# Altium schematic sheet MAX487.SchDoc
size 297 x 209 mm; SheetNumber: 4; SheetTotal: 12
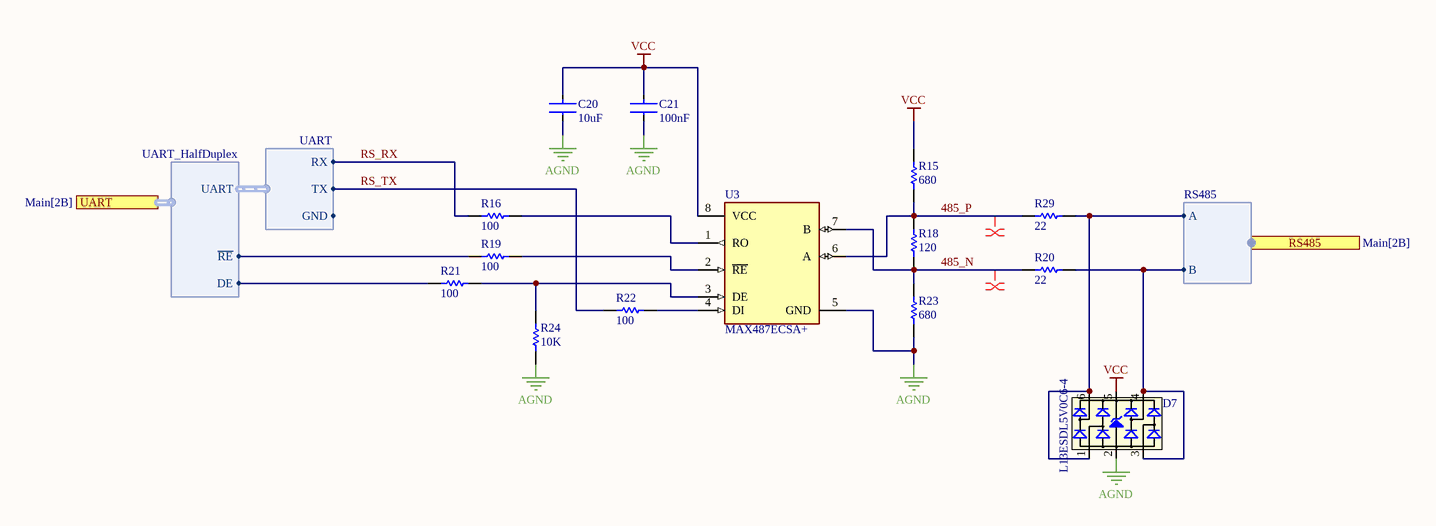
[diagram p0: MAX487.SchDoc]

## Parts
C20  10uF  [CAP-0603]
C21  100nF  [CAP-0603]
D7  L13ESDL5V0C6-4  [SOT23_6L]
R15  680  [RES-0603]
R16  100  [RES-0603]
R18  120  [RES-0603]
R19  100  [RES-0603]
R20  22  [RES-0603]
R21  100  [RES-0603]
R22  100  [RES-0603]
R23  680  [RES-0603]
R24  10K  [RES-0603]
R29  22  [RES-0603]
U3  MAX487ECSA+  [FP-S8-5-MFG]

## Ports
RS485 (harness RS485, see Main[2B]), UART (harness UART_HalfDuplex, see Main[2B])

## Harnesses
RS485: B, A
UART: TX, RX, GND
UART_HalfDuplex: ~{RE}, DE, UART

## Nets
AGND: C20.2 C21.2 D7.2(GND) R23.1 R24.1 U3.5(GND)
VCC: C20.1 C21.1 D7.5(VDD) R15.2 U3.8(VCC)
485_N: R18.1 R20.2 R23.2 U3.7(B)
485_P: R15.1 R18.2 R29.2 U3.6(A)
RS_RX: R16.1 ; harness UART.RX
RS_TX: R22.1 ; harness UART.TX
NetD7_1: D7.1(I/O1) D7.6(I/O4) R29.1 ; port RS485.A
NetD7_3: D7.3(I/O2) D7.4(I/O3) R20.1 ; port RS485.B
NetR16_2: R16.2 U3.1(RO)
NetR19_1: R19.1 ; port UART.~{RE}
NetR19_2: R19.2 U3.2(~{RE})
NetR21_1: R21.1 ; port UART.DE
NetR21_2: R21.2 R24.2 U3.3(DE)
NetR22_2: R22.2 U3.4(DI)

## Layout directives
differential pair: 485_N, 485_P

## Notes on the sheet
- Title
- Size:
- Date:
- A4
- Variant :
- Time:
- Sheet
- Revision:
- of
- Company Link :
- Designer:
- Designer Link:
- www.fatehscan.com
- File:

## Library data of the parts
C20 C21 = CAP-Ceramic: Chip Multilayer Ceramic Capacitors for General Purpose, 0603; Voltage Rating (DC): 6.3V; Dielectric: X5R; Tolerance: 20%; Packaging: Tape and Reel; Width: 0.031inch; Termination: SMD/SMT; Package Quantity: 4000; Voltage Rating: 6.3V; Case/Package: 0603; Min Operating Temperature: -55°C; Voltage: 6.3V; Length: 1.6mm; Thickness: 0.035inch; Lead Free: Lead Free; Depth: 0.8mm; Case Code (Imperial): 0603; Max Operating Temperature: 85°C; Material: Ceramic; Height: 0.8mm; Mount: Surface Mount; REACH SVHC: No SVHC; Radiation Hardening: No; Case Code (Metric): 1608
  C20: Capacitance: 10uF
  C21: Capacitance: 100nF
D7 = CMP-1486-00004-1: TVS Diode WE-TVS-HS, VRWM=5V; Reverse Stand Off Voltage: 5V; Number of Channels: 4 Channel; ComponentLink2Description: Datasheet; ComponentLink2URL: https://www.javanelec.com/CustomAjax/GetAppDocument/f6ec3046-032c-4095-b63d-5dd0486e1189?type=1&inlineName=True; PartNumber: L13ESDL5V0C6-4; PackageReference: SOT23_6L
R15 R23 = RES_SMD: Chip Resistor; Manufacturer: Vishay Semiconductor; Voltage Rating: 75 V; value: 390; Min Operating Temperature: -55 degC; ComponentLink1URL: http://www.vishay.com/; ComponentLink1Description: Manufacturer URL; PackageReference: =Footprints; Packaging: Tape and Reel; Max Operating Temperature: 155 degC; Mount: Surface Mount; ComponentLink2Description: Datasheet; PackageDescription: 2-Pin Surface Mount Device, Body 1.575 x 0.85 mm; Length: 1.55 mm; ComponentLink2URL: http://www.vishay.com/docs/20035/dcrcwe3.pdf; Pins: 2; RoHSCompliant: true
R16 R19-R22 R24 R29 = RES_SMD: Chip Resistor; Manufacturer: Vishay Semiconductor; Voltage Rating: 75 V; Min Operating Temperature: -55 degC; ComponentLink1URL: http://www.vishay.com/; ComponentLink1Description: Manufacturer URL; PackageReference: =Footprints; Packaging: Tape and Reel; Max Operating Temperature: 155 degC; Mount: Surface Mount; ComponentLink2Description: Datasheet; PackageDescription: 2-Pin Surface Mount Device, Body 1.575 x 0.85 mm; Length: 1.55 mm; ComponentLink2URL: http://www.vishay.com/docs/20035/dcrcwe3.pdf; Pins: 2; RoHSCompliant: true
  R16 R19 R21 R22: value: 100
  R20 R29: value: 22
  R24: value: 10K
R18 = RES_SMD: Chip Resistor; Manufacturer: Vishay Semiconductor; Voltage Rating: 75 V; value: 220; Min Operating Temperature: -55 degC; ComponentLink1URL: http://www.vishay.com/; ComponentLink1Description: Manufacturer URL; PackageReference: =Footprints; Packaging: Tape and Reel; Max Operating Temperature: 155 degC; Mount: Surface Mount; ComponentLink2Description: Datasheet; PackageDescription: 2-Pin Surface Mount Device, Body 1.575 x 0.85 mm; Length: 1.55 mm; ComponentLink2URL: http://www.vishay.com/docs/20035/dcrcwe3.pdf; Pins: 2; RoHSCompliant: true
U3 = CMP-05679-000019-1: IC TXRX RS485/RS422 8-SOIC; Manufacturer: Maxim Integrated; Number Of Receivers: 1; Interface: RS-485,RS-422; Min Supply Voltage: 4.75V; Max Supply Voltage: 5.25V; Standoff Height: 0.1mm; Simplex Duplex: Half Duplex; Data Rate: 250kbits/s; Nominal Supply Current: 230-300uA; ComponentLink2Description: Datasheet; Octopart: https://octopart.com/max487ecsa%2B-maxim+integrated-39434994; Category: IC; Lead Free: Yes; Digikey Description: IC TXRX RS485/RS422 8-SOIC; Mouser Description: RS-422/RS-485 Interface IC RS-485/RS-422 Transceiver; Device Class L3: RS-232 / RS-422 / RS-485 Interface ICs; Footprint Url: https://pdfserv.maximintegrated.com/land_patterns/90-0096.PDF; Automotive: No; RoHS: TRUE; Temperature Range High: +70°C; Number Of Transmitters: 1; Device Class L1: Integrated Circuits (ICs); Temperature: 0°C to +70°C; Package: S8-5; Height: 1.75mm; Device Class L2: Interface ICs; Temperature Range Low: 0°C; Manufacturer Part Number: MAX487ECSA+; ComponentLink2URL: https://datasheets.maximintegrated.com/en/ds/MAX1487E-MAX491E.pdf